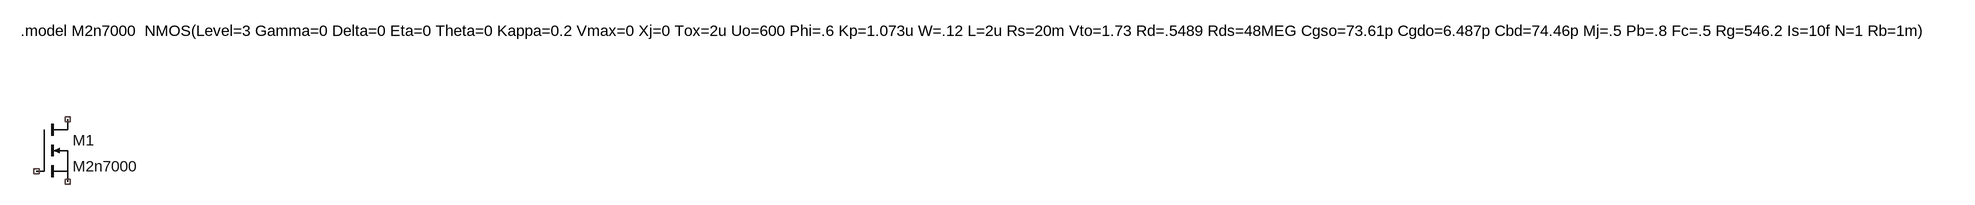
[diagram p0: schematic Draft1.asc]
Draft1.asc, the LTspice schematic file:
Version 4
SHEET 1 3372 680
SYMBOL nmos 160 80 R0
SYMATTR InstName M1
SYMATTR Value M2n7000
TEXT 136 -56 Left 2 !.model M2n7000  NMOS(Level=3 Gamma=0 Delta=0 Eta=0 Theta=0 Kappa=0.2 Vmax=0 Xj=0 Tox=2u Uo=600 Phi=.6 Kp=1.073u W=.12 L=2u Rs=20m Vto=1.73 Rd=.5489 Rds=48MEG Cgso=73.61p Cgdo=6.487p Cbd=74.46p Mj=.5 Pb=.8 Fc=.5 Rg=546.2 Is=10f N=1 Rb=1m)

The netlist it stands for:
* Draft1.asc
M1 NC_01 NC_02 NC_03 NC_03 M2n7000
.model NMOS NMOS
.model PMOS PMOS
.lib standard.mos
.model M2n7000  NMOS(Level=3 Gamma=0 Delta=0 Eta=0 Theta=0 Kappa=0.2 Vmax=0 Xj=0 Tox=2u Uo=600 Phi=.6 Kp=1.073u W=.12 L=2u Rs=20m Vto=1.73 Rd=.5489 Rds=48MEG Cgso=73.61p Cgdo=6.487p Cbd=74.46p Mj=.5 Pb=.8 Fc=.5 Rg=546.2 Is=10f N=1 Rb=1m)
.backanno
.end